# EAGLE schematic LED_Panel_Driver (EAGLE 8.0.1)
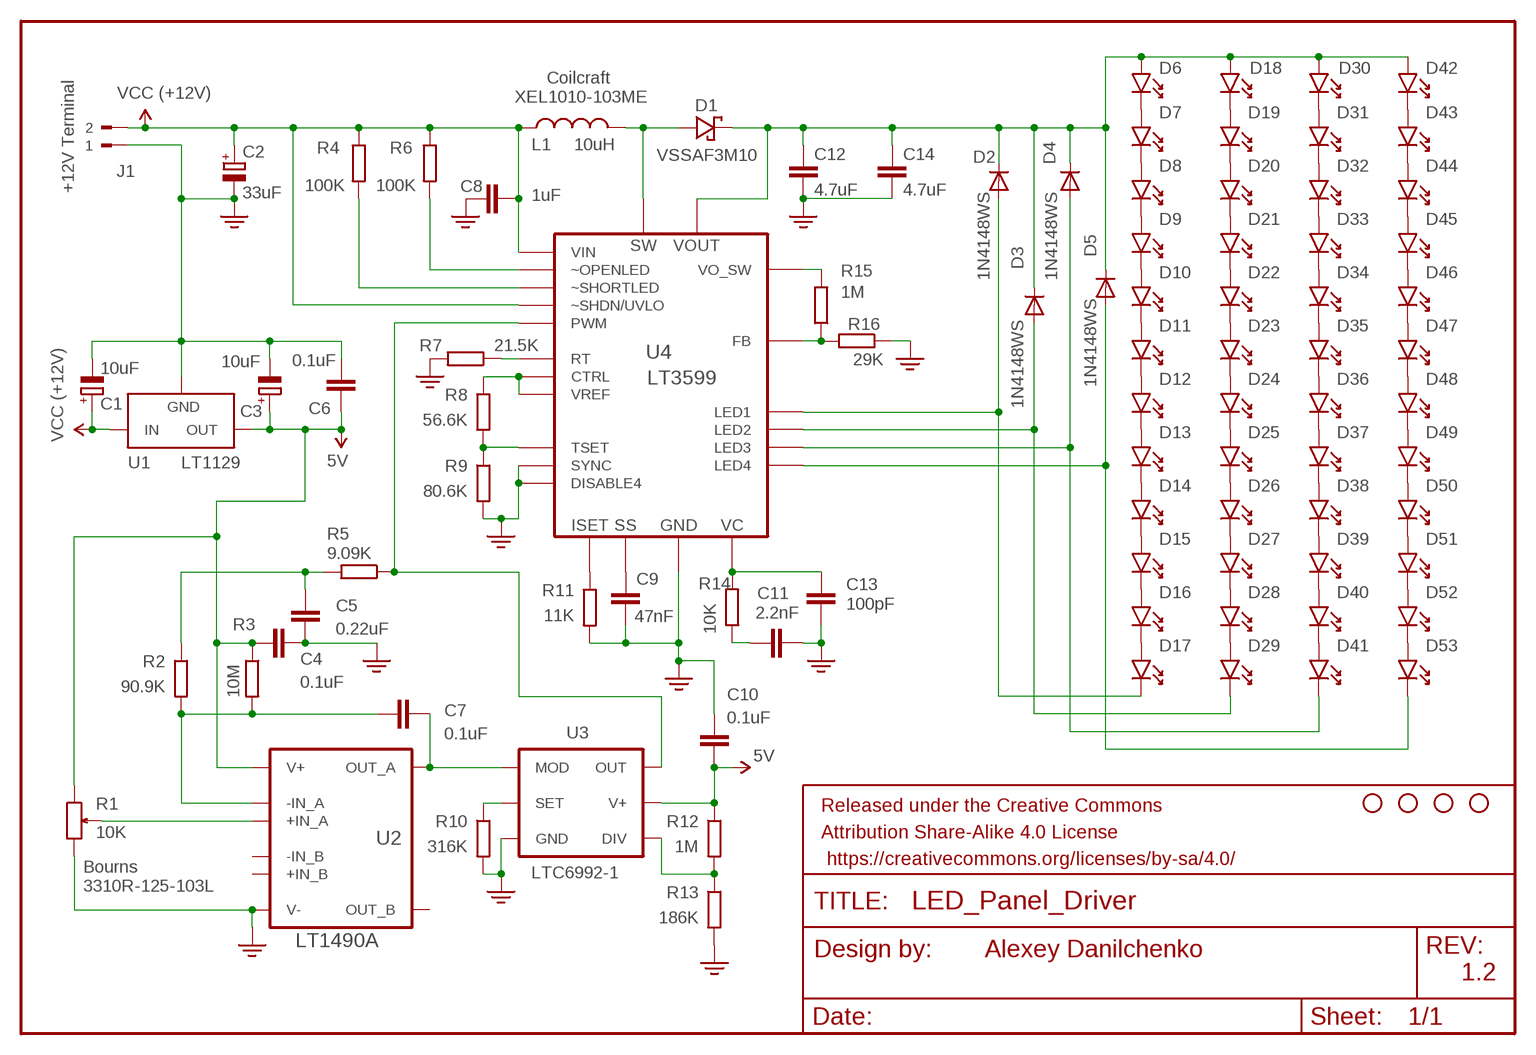
[diagram p0: schematic, sheet 1]

## Parts
C1  10uF  CPOL-EUCT7343  [CT7343]
C2  33uF  CPOL-EUE  [PANASONIC_E]
C3  10uF  CPOL-EUCT7343  [CT7343]
C4  0.1uF  C-EUC0805  [C0805]
C5  0.22uF  C-EUC0805  [C0805]
C6  0.1uF  C-EUC0805  [C0805]
C7  0.1uF  C-EUC0805  [C0805]
C8  1uF  C-EUC0805  [C0805]
C9  47nF  C-EUC0805  [C0805]
C10  0.1uF  C-EUC0805  [C0805]
C11  2.2nF  C-EUC0805  [C0805]
C12  4.7uF  C-EUC1812  [C1812]
C13  100pF  C-EUC0805  [C0805]
C14  4.7uF  C-EUC1812  [C1812]
D1  VSSAF3M10  VSSAF3M10-M3_H  [SODFL5226X100N]
D2  1N4148WS  DIODESOD-323F  [SOD-323F]
D3  1N4148WS  DIODESOD-323F  [SOD-323F]
D4  1N4148WS  DIODESOD-323F  [SOD-323F]
D5  1N4148WS  DIODESOD-323F  [SOD-323F]
D6  YUJI_D50  [YUJI_D50]
D7  YUJI_D50  [YUJI_D50]
D8  YUJI_D50  [YUJI_D50]
D9  YUJI_D50  [YUJI_D50]
D10  YUJI_D50  [YUJI_D50]
D11  YUJI_D50  [YUJI_D50]
D12  YUJI_D50  [YUJI_D50]
D13  YUJI_D50  [YUJI_D50]
D14  YUJI_D50  [YUJI_D50]
D15  YUJI_D50  [YUJI_D50]
D16  YUJI_D50  [YUJI_D50]
D17  YUJI_D50  [YUJI_D50]
D18  YUJI_D50  [YUJI_D50]
D19  YUJI_D50  [YUJI_D50]
D20  YUJI_D50  [YUJI_D50]
D21  YUJI_D50  [YUJI_D50]
D22  YUJI_D50  [YUJI_D50]
D23  YUJI_D50  [YUJI_D50]
D24  YUJI_D50  [YUJI_D50]
D25  YUJI_D50  [YUJI_D50]
D26  YUJI_D50  [YUJI_D50]
D27  YUJI_D50  [YUJI_D50]
D28  YUJI_D50  [YUJI_D50]
D29  YUJI_D50  [YUJI_D50]
D30  YUJI_D50  [YUJI_D50]
D31  YUJI_D50  [YUJI_D50]
D32  YUJI_D50  [YUJI_D50]
D33  YUJI_D50  [YUJI_D50]
D34  YUJI_D50  [YUJI_D50]
D35  YUJI_D50  [YUJI_D50]
D36  YUJI_D50  [YUJI_D50]
D37  YUJI_D50  [YUJI_D50]
D38  YUJI_D50  [YUJI_D50]
D39  YUJI_D50  [YUJI_D50]
D40  YUJI_D50  [YUJI_D50]
D41  YUJI_D50  [YUJI_D50]
D42  YUJI_D50  [YUJI_D50]
D43  YUJI_D50  [YUJI_D50]
D44  YUJI_D50  [YUJI_D50]
D45  YUJI_D50  [YUJI_D50]
D46  YUJI_D50  [YUJI_D50]
D47  YUJI_D50  [YUJI_D50]
D48  YUJI_D50  [YUJI_D50]
D49  YUJI_D50  [YUJI_D50]
D50  YUJI_D50  [YUJI_D50]
D51  YUJI_D50  [YUJI_D50]
D52  YUJI_D50  [YUJI_D50]
D53  YUJI_D50  [YUJI_D50]
FRAME1  FRAME-LEDGER  [CREATIVE_COMMONS]
J1  +12V Terminal  PM5.08/2/90BLK  [WEIDMULLER_PM5.08_2]
L1  10uH  XAL1010  [XAL1010]
R1  10K  3310R-125-103L  [3310R125103L]
R2  90.9K  R-EU_R0805  [R0805]
R3  10M  R-EU_R0805  [R0805]
R4  100K  R-EU_R0805  [R0805]
R5  9.09K  R-EU_R0805  [R0805]
R6  100K  R-EU_R0805  [R0805]
R7  21.5K  R-EU_R0805  [R0805]
R8  56.6K  R-EU_R0805  [R0805]
R9  80.6K  R-EU_R0805  [R0805]
R10  316K  R-EU_R0805  [R0805]
R11  11K  R-EU_R0805  [R0805]
R12  1M  R-EU_R0805  [R0805]
R13  186K  R-EU_R0805  [R0805]
R14  10K  R-EU_R0805  [R0805]
R15  1M  R-EU_R0805  [R0805]
R16  29K  R-EU_R0805  [R0805]
STANDOFF1  STAND-OFF  [STAND-OFF]
STANDOFF2  STAND-OFF  [STAND-OFF]
STANDOFF3  STAND-OFF  [STAND-OFF]
STANDOFF4  STAND-OFF  [STAND-OFF]
U1  LT1129  LT1129CST5  [SOT223]
U2  LT1490A  LT1490ACS8PBF  [SOIC127P600X175-8N]
U3  LTC6992-1  LTC6992CS6-1TRPBF  [SOT95P280X100-6N]
U4  LT3599  LT3599EFEPBF  [SOP65P640X120-29N]

## Nets
5V: C3.+ C4.2 C6.1 C10.1 R1.3(CCW) R3.1 R12.1 U1.3(OUT) U2.8(V+) U3.5(V+)
GND: C1.- C2.- C3.- C4.1 C5.1 C6.2 C8.2 C9.2 C10.2 C11.2 C12.2 C13.2 C14.2 J1.1 R1.1(CW) R7.2 R9.2 R10.2 R11.2 R13.2 R16.1 U1.2(GND) U2.4(V-) U3.2(GND) U4.8(DISABLE4) U4.19(SYNC) U4.25(GND) U4.29(GND)
N$1: R8.2 R9.1 U4.17(TSET)
N$2: D1.2(A) L1.2 U4.1(SW)
N$3: C12.1 C14.1 D1.1(K) D2.C D3.C D4.C D5.C D6.ANODE D18.ANODE D30.ANODE D42.ANODE U4.2(VOUT)
N$4: R15.1 R16.2 U4.16(FB)
N$5: D22.CATHODE D23.ANODE
N$6: D46.CATHODE D47.ANODE
N$7: D2.A D17.CATHODE U4.4(LED1)
N$8: R8.1 U4.14(CTRL) U4.24(VREF)
N$9: D6.CATHODE D7.ANODE
N$10: D3.A D29.CATHODE U4.5(LED2)
N$11: C9.1 U4.23(SS)
N$12: R15.2 U4.3(VO_SW)
N$13: R11.1 U4.13(ISET)
N$14: R7.1 U4.22(RT)
N$15: C13.1 R14.2 U4.15(VC)
N$16: C11.1 R14.1
N$17: R6.2 U4.11(~OPENLED)
N$18: R4.2 U4.9(~SHORTLED)
N$19: D7.CATHODE D8.ANODE
N$20: D8.CATHODE D9.ANODE
N$21: D9.CATHODE D10.ANODE
N$22: D11.CATHODE D12.ANODE
N$23: D12.CATHODE D13.ANODE
N$24: D13.CATHODE D14.ANODE
N$25: D14.CATHODE D15.ANODE
N$26: D15.CATHODE D16.ANODE
N$27: D16.CATHODE D17.ANODE
N$28: D10.CATHODE D11.ANODE
N$29: D18.CATHODE D19.ANODE
N$30: D19.CATHODE D20.ANODE
N$31: D20.CATHODE D21.ANODE
N$32: D21.CATHODE D22.ANODE
N$33: D23.CATHODE D24.ANODE
N$34: D24.CATHODE D25.ANODE
N$35: D25.CATHODE D26.ANODE
N$36: D26.CATHODE D27.ANODE
N$37: D27.CATHODE D28.ANODE
N$38: D28.CATHODE D29.ANODE
N$39: D30.CATHODE D31.ANODE
N$40: D31.CATHODE D32.ANODE
N$41: D32.CATHODE D33.ANODE
N$42: D33.CATHODE D34.ANODE
N$43: D35.CATHODE D36.ANODE
N$44: D36.CATHODE D37.ANODE
N$45: D37.CATHODE D38.ANODE
N$46: D38.CATHODE D39.ANODE
N$47: D39.CATHODE D40.ANODE
N$48: D40.CATHODE D41.ANODE
N$49: D34.CATHODE D35.ANODE
N$50: D42.CATHODE D43.ANODE
N$51: D43.CATHODE D44.ANODE
N$52: D44.CATHODE D45.ANODE
N$53: D45.CATHODE D46.ANODE
N$54: D47.CATHODE D48.ANODE
N$55: D48.CATHODE D49.ANODE
N$56: D49.CATHODE D50.ANODE
N$57: D50.CATHODE D51.ANODE
N$58: D51.CATHODE D52.ANODE
N$59: D52.CATHODE D53.ANODE
N$60: D4.A D41.CATHODE U4.6(LED3)
N$61: D5.A D53.CATHODE U4.7(LED4)
N$62: R10.1 U3.3(SET)
N$63: C7.2 R2.2 R3.2 U2.2(-IN_A)
N$64: C7.1 U2.1(OUT_A) U3.1(MOD)
N$65: R5.1 U3.6(OUT) U4.21(PWM)
N$66: R1.2(WIPER) U2.3(+IN_A)
N$67: R12.2 R13.1 U3.4(DIV)
N$68: C5.2 R2.1 R5.2
VDD: C1.+ C2.+ C8.1 J1.2 L1.1 R4.1 R6.1 U1.1(IN) U4.27(~SHDN/UVLO) U4.28(VIN) ; supply symbol labelled VCC (+12V)
Unconnected: U2.5(+IN_B) U2.6(-IN_B) U2.7(OUT_B)

## Notes on the sheet
- Coilcraft 
  XEL1010-103ME
- Bourns 
  3310R-125-103L
- Alexey Danilchenko
- 1.2

## Power pins joined to a net without a drawn wire
GND: U1.4(GND)

## Library data of the parts
C1 C3 = Spectron:CPOL-EU: POLARIZED CAPACITOR, European symbol
C2 = resistor:CPOL-EU: POLARIZED CAPACITOR, European symbol
C4 C5 C7-C11 C13 = rcl:C-EU: CAPACITOR, European symbol
C6 C12 C14 = Spectron2:C-EU: CAPACITOR, European symbol
D1 = VSSAF3M10-M3_H:VSSAF3M10-M3_H: Schottky Diodes & Rectifiers TMBS 100V Vrrm eSMP SlimSMA (DO-221AC) Source: Datasheet <https://www.vishay.com/docs/87507/vssaf3m10.pdf>; ARROW_PART_NUMBER: VSSAF3M10-M3/H; ARROW_PRICE/STOCK: https://www.arrow.com/en/products/vssaf3m10-m3h/vishay; DESCRIPTION: Schottky Diodes & Rectifiers TMBS 100V Vrrm eSMP SlimSMA (DO-221AC); HEIGHT: 1mm; MANUFACTURER_NAME: Vishay; MANUFACTURER_PART_NUMBER: VSSAF3M10-M3/H
D2-D5 = adafruit:DIODE: Diode SMADIODE - SMA Surface Mount Package 20V 1A Schottky Diode Digikey: 641-1014-6-ND DO-1N4148 - Through Hole Small Current Diode SOD-123 20V 1 A (.5mV Vf) Schottky Diode - Digikey: MBRX120TPMSCT-ND SOD-323 10V 570mA (.38mV Vf, 3ns) Schottky Diode - Digikey: ZLLS410CT-ND SOD-523 30V 30mA Schottky Diode (RB751S-40TE61) - Digikey: RB751S-40TE61CT-ND SOT23-R/W - SOT23 Package (R = Solder Paste/Reflow Ovens, W = Hand-Soldering) BAT54Film 40V 300mA - Digikey: 497-7162-1-ND
D6-D53 = Yuji_LED:YUJI_D50
FRAME1 = LEDS:FRAME-LEDGER: Schematic Frame Standard 11x14 US Ledger frame
J1 = WEIDMULLER-PM5.08_2_90BLK:PM5.08/2/90BLK: TERMINAL BLOCK, SIDE ENTRY, 2WAY; MPN: PM5.08/2/90 BLK; OC_FARNELL: 1131855; OC_NEWARK: 26M1980; PACKAGE: TH-R/A; SUPPLIER: WEIDMULLER
L1 = LEDS:XAL1010
R1 = 3310R-125-103L:3310R-125-103L: BOURNS - 3310R-125-103L - POT, ROTARY, 10KOHM, 9MM, 20% Source: Datasheet <https://www.bourns.com/docs/Product-Datasheets/3310.pdf>; ALLIED_NUMBER: 71024309; ALLIED_PRICE/STOCK: https://www.alliedelec.com/bourns-3310r-125-103l/71024309/; ARROW_PART_NUMBER: 3310R-125-103L; ARROW_PRICE/STOCK: https://www.arrow.com/en/products/3310r-125-103l/bourns; DESCRIPTION: BOURNS - 3310R-125-103L - POT, ROTARY, 10KOHM, 9MM, 20%; HEIGHT: 17mm; MANUFACTURER_NAME: Bourns; MANUFACTURER_PART_NUMBER: 3310R-125-103L
R2-R16 = Spectron2:R-EU_: RESISTOR, European symbol
STANDOFF1-STANDOFF4 = Spectron2:STAND-OFF: #4 Stand Off This is the mechanical footprint for a #4 phillips button head screw. Use the keepout ring to avoid running the screw head into surrounding components. SKU : PRT-00447
U1 = linear-technology-3:LT1129CST5: VOLTAGE REGULATOR with shutdown
U2 = LTC_By_element14_Batch_1:LT1490ACS8PBF: Dual and Quad Micropower Rail-to-Rail Input and Output Op Amps; MPN: LT1490ACS8#PBF; OC_FARNELL: 1663433; OC_NEWARK: 57M4410; PACKAGE: SOIC-8; SUPPLIER: Linear Technologies
U3 = LTC_By_element14_Batch_1:LTC6992CS6-1TRPBF: TimerBlox: Voltage-Controlled Pulse Width Modulator (PWM); MPN: LTC6992CS6-1#TRPBF; OC_FARNELL: -; OC_NEWARK: 87R1640; PACKAGE: TSOT-23-6; SUPPLIER: Linear Technology
U4 = LTC_By_element14_Batch_1:LT3599EFEPBF: LED Driver; MPN: LT3599EFE#PBF; OC_FARNELL: -; OC_NEWARK: 46P4018; PACKAGE: TSSOP-28; SUPPLIER: Linear Technology